# EAGLE design barometre_main_v2.2 (EAGLE 9.6.2)
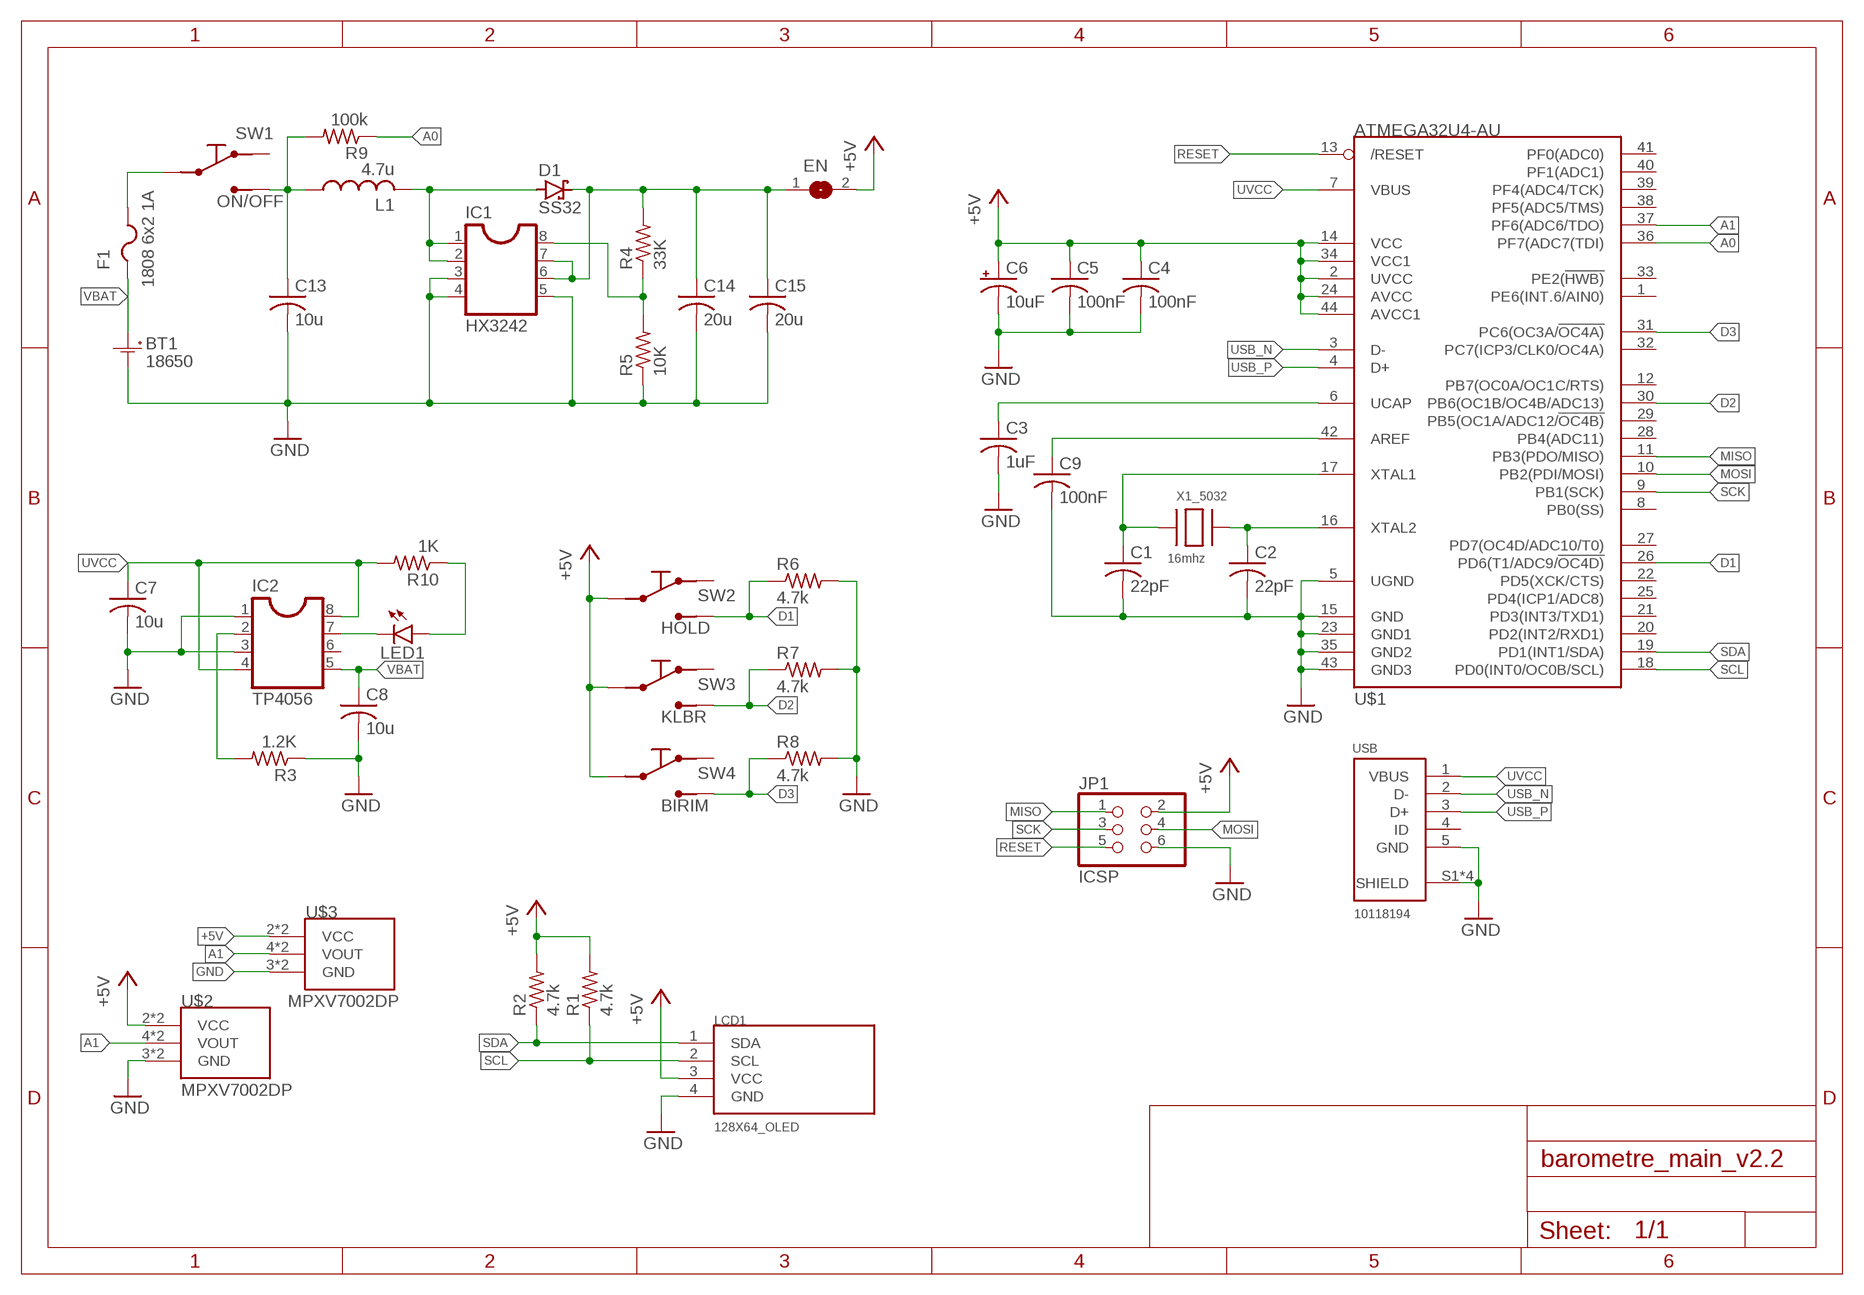
[diagram p0: schematic, sheet 1]

## Parts
BT1  18650  18650_BATTERY  [18650_PCB]
C1  22pF  C-USC0805  [C0805]
C2  22pF  C-USC0805  [C0805]
C3  1uF  C-USC0805  [C0805]
C4  100nF  C-USC0805  [C0805]
C5  100nF  C-USC0805  [C0805]
C6  10uF  CPOL-USSMCB  [SMC_B]
C7  10u  C-USC0805  [C0805]
C8  10u  C-USC0805  [C0805]
C9  100nF  C-USC0805  [C0805]
C13  10u  C-USC0805  [C0805]
C14  20u  C-USC0805  [C0805]
C15  20u  C-USC0805  [C0805]
D1  SS32  SCHOTTKY-DIODESMC  [SMC]
EN  SJ  [SJ]
F1  1808 6x2 1A  PTCFUSE-1812  [1812]
IC1  HX3242  IC_DIL8-SOIC8  [SO-8]
IC2  TP4056  IC_DIL8-SOIC8  [SO-8]
JP1  ICSP  PINHD-2X3  [2X03]
L1  4.7u  L-USL5650M  [L5650M]
LCD1  128X64_OLED  [128X64_OLED]
LED1  LEDCHIPLED_0805  [CHIPLED_0805]
R1  4.7k  R-US_R0805  [R0805]
R2  4.7k  R-US_R0805  [R0805]
R3  1.2K  R-US_R0805  [R0805]
R4  33K  R-US_R0805  [R0805]
R5  10K  R-US_R0805  [R0805]
R6  4.7k  R-US_R0805  [R0805]
R7  4.7k  R-US_R0805  [R0805]
R8  4.7k  R-US_R0805  [R0805]
R9  100k  R-US_R0805  [R0805]
R10  1K  R-US_R0805  [R0805]
SW1  ON/OFF  BUTTON_6_PIN  [BUTTON_6_PIN]
SW2  HOLD  BUTTON_6_PIN  [BUTTON_6_PIN]
SW3  KLBR  BUTTON_6_PIN  [BUTTON_6_PIN]
SW4  BIRIM  BUTTON_6_PIN  [BUTTON_6_PIN]
U$1  ATMEGA32U4-AU  [TQFP44]
U$2  MPXV7002DP  [MPXV7002DP]
U$3  MPXV7002DP  [MPXV7002DP]
USB  10118194  MICRO_USB  [10118194]
X1_5032  16mhz  XTALNX5032  [NX5032]

## Nets
+5V: C4.1 C5.1 C6.+ EN.2 JP1.2 LCD1.3(VCC) R1.2 R2.2 SW2.P$2 SW2.P$5 SW3.P$2 SW3.P$5 SW4.P$2 SW4.P$5 U$1.2(UVCC) U$1.14(VCC) U$1.24(AVCC) U$1.34(VCC1) U$1.44(AVCC1) U$2.2(VCC) U$2.P$2(VCC) U$3.2(VCC) U$3.P$2(VCC)
A0: R9.1 U$1.36(PF7(ADC7(TDI))
A1: U$1.37(PF6(ADC6/TDO)) U$2.4(VOUT) U$2.P$4(VOUT) U$3.4(VOUT) U$3.P$4(VOUT)
D1: R6.1 SW2.P$1 SW2.P$6 U$1.26(PD6(T1/ADC9/!OC4D))
D2: R7.1 SW3.P$1 SW3.P$6 U$1.30(PB6(OC1B/OC4B/ADC13))
D3: R8.1 SW4.P$1 SW4.P$6 U$1.31(PC6(OC3A/!OC4A))
GND: BT1.N C1.2 C2.2 C3.2 C4.2 C5.2 C6.- C7.2 C8.2 C9.2 C13.2 C14.2 C15.2 IC1.3 IC1.4 IC1.5 IC2.1 IC2.3 JP1.6 LCD1.4(GND) R3.1 R5.1 R6.2 R7.2 R8.2 U$1.5(UGND) U$1.15(GND) U$1.23(GND1) U$1.35(GND2) U$1.43(GND3) U$2.3(GND) U$2.P$3(GND) U$3.3(GND) U$3.P$3(GND) USB.5(GND) USB.S1(SHIELD) USB.S2(SHIELD) USB.S3(SHIELD) USB.S6(SHIELD)
MISO: JP1.1 U$1.11(PB3(PDO/MISO))
MOSI: JP1.4 U$1.10(PB2(PDI/MOSI))
N$1: IC2.2 R3.2
N$2: C3.1 U$1.6(UCAP)
N$3: C1.1 U$1.17(XTAL1) X1_5032.P$1
N$4: C2.1 U$1.16(XTAL2) X1_5032.P$2
N$5: LED1.A R10.1
N$6: F1.2 SW1.P$2 SW1.P$5
N$7: D1.A IC1.1 IC1.2 L1.2
N$8: C13.1 L1.1 R9.2 SW1.P$1 SW1.P$6
N$9: IC2.7 LED1.C
N$10: C9.1 U$1.42(AREF)
N$13: IC1.8 R4.1 R5.2
N$15: C14.1 C15.1 D1.C EN.1 IC1.6 IC1.7 R4.2
RESET: JP1.5 U$1.13(/RESET)
SCK: JP1.3 U$1.9(PB1(SCK))
SCL: LCD1.2(SCL) R1.1 U$1.18(PD0(INT0/OC0B/SCL))
SDA: LCD1.1(SDA) R2.1 U$1.19(PD1(INT1/SDA))
USB_N: U$1.3(D-) USB.2(D-)
USB_P: U$1.4(D+) USB.3(D+)
UVCC: C7.1 IC2.4 IC2.8 R10.2 U$1.7(VBUS) USB.1(VBUS)
VBAT: BT1.P C8.1 F1.1 IC2.5
Unconnected: IC2.6 SW1.P$3 SW1.P$4 SW2.P$3 SW2.P$4 SW3.P$3 SW3.P$4 SW4.P$3 SW4.P$4 U$1.1(PE6(INT.6/AIN0)) U$1.8(PB0(SS)) U$1.12(PB7(OC0A/OC1C/RTS)) U$1.20(PD2(INT2/RXD1)) U$1.21(PD3(INT3/TXD1)) U$1.22(PD5(XCK/CTS)) U$1.25(PD4(ICP1/ADC8)) U$1.27(PD7(OC4D/ADC10/T0)) U$1.28(PB4(ADC11)) U$1.29(PB5(OC1A/ADC12/!OC4B)) U$1.32(PC7(ICP3/CLK0/OC4A)) U$1.33(PE2(!HWB)) U$1.38(PF5(ADC5/TMS)) U$1.39(PF4(ADC4/TCK)) U$1.40(PF1(ADC1)) U$1.41(PF0(ADC0)) USB.4(ID)

## Library data of the parts
BT1 = 1-my-library:18650_BATTERY
C1-C5 C7-C9 C13-C15 = rcl:C-US: CAPACITOR, American symbol; SPICEPREFIX: C
C6 = rcl:CPOL-US: POLARIZED CAPACITOR, American symbol; SPICEPREFIX: C
D1 = diode:SCHOTTKY-DIODE: Schottky Diode
EN = jumper:SJ: SMD solder JUMPER
F1 = adafruit:PTCFUSE: PTC fuses, resettable thermistors
IC1 IC2 = dp_devices.v6:IC_DIL8: Universal 8pins IC
JP1 = pinhead:PINHD-2X3: PIN HEADER
L1 = rcl:L-US: INDUCTOR, American symbol; SPICEPREFIX: L
LCD1 = 1-my-library:128X64_OLED
LED1 = led:LED: LED OSRAM: - CHIPLED LG R971, LG N971, LY N971, LG Q971, LY Q971, LO R971, LY R971 LH N974, LH R974 LS Q976, LO Q976, LY Q976 LO Q996 - Hyper CHIPLED LW Q18S LB Q993, LB Q99A, LB R99A - SideLED LS A670, LO A670, LY A670, LG A670, LP A670 LB A673, LV A673, LT A673, LW A673 LH A674 LY A675 LS A676, LA A676, LO A676, LY A676, LW A676 LS A679, LY A679, LG A679 - Hyper Micro SIDELED® LS Y876, LA Y876, LO Y876, LY Y876 LT Y87S - SmartLED LW L88C, LW L88S LB L89C, LB L89S, LG L890 LS L89K, LO L89K, LY L89K LS L896, LA L896, LO L896, LY L896 - TOPLED LS T670, LO T670, LY T670, LG T670, LP T670 LSG T670, LSP T670, LSY T670, LOP T670, LYG T670 LG T671, LOG T671, LSG T671 LB T673, LV T673, LT T673, LW T673 LH T674 LS T676, LA T676, LO T676, LY T676, LB T676, LH T676, LSB T676, LW T676 LB T67C, LV T67C, LT T67C, LS T67K, LO T67K, LY T67K, LW E67C LS E67B, LA E67B, LO E67B, LY E67B, LB E67C, LV E67C, LT E67C LW T67C LS T679, LY T679, LG T679 LS T770, LO T770, LY T770, LG T770, LP T770 LB T773, LV T773, LT T773, LW T773 LH T774 LS E675, LA E675, LY E675, LS T675 LS T776, LA T776, LO T776, LY T776, LB T776 LHGB T686 LT T68C, LB T68C - Hyper Mini TOPLED® LB M676 - Mini TOPLED Santana® LG M470 LS M47K, LO M47K, LY M47K Source: http://www.osram.convergy.de LUXEON: - LUMILED® LXK2-PW12-R00, LXK2-PW12-S00, LXK2-PW14-U00, LXK2-PW14-V00 LXK2-PM12-R00, LXK2-PM12-S00, LXK2-PM14-U00 LXK2-PE12-Q00, LXK2-PE12-R00, LXK2-PE12-S00, LXK2-PE14-T00, LXK2-PE14-U00 LXK2-PB12-K00, LXK2-PB12-L00, LXK2-PB12-M00, LXK2-PB14-N00, LXK2-PB14-P00, LXK2-PB14-Q00 LXK2-PR12-L00, LXK2-PR12-M00, LXK2-PR14-Q00, LXK2-PR14-R00 LXK2-PD12-Q00, LXK2-PD12-R00, LXK2-PD12-S00 LXK2-PH12-R00, LXK2-PH12-S00 LXK2-PL12-P00, LXK2-PL12-Q00, LXK2-PL12-R00 Source: www.luxeon.com KINGBRIGHT: KA-3528ASYC Source: www.kingbright.com
R1-R10 = rcl:R-US_: RESISTOR, American symbol; SPICEPREFIX: R
SW1-SW4 = 1-my-library:BUTTON_6_PIN: 8x8 6 Pin Buton ve Anahtar
U$1 = adafruit:ATMEGA32U4: http://www.ladyada.net/library/eagle
U$2 U$3 = 1-my-library:MPXV7002DP
USB = 1-my-library:MICRO_USB: CONN RCPT USB2.0 MICRO B SMD R/A Manufacturer's datasheet <https://www.amphenol-icc.com/media/wysiwyg/files/drawing/10118194.pdf?__cf_chl_jschl_tk__=1e9b4569481076e99900b246ea640525553a7b60-1588047333-0-AZhEk6D50lwOf6CdaXmV1teudqMKHMxqtb1pEtnUtu77sOc-OVRjbCmHdORomVnr0W49D2E8XkcMdJ2SdWt5rDDYIblyJz7fSv-zilM8vQKAQDC1Z9aMVORhnMgYjPDuz8XpfDLul_eaqqFpemo1xIgoZv50WTuLMwu26ci7e02s9PWvR3z1cDqm9GMGYIPwIUd9yh5-TtN_o6DbEkadC7zoJlhYZSw-VEaYzfWnBSFg_n44fbEB3slHLR2YKLSiTmh8RSwpxKUP4gER0KeVoie9w-Ibtx3oKQbsZjrsPLGSu9BzV2nf3QeoErALCQuycvY9WhQdebLIpxaon6SXufpVIIdoKZHRpjuVVlAkUIr9oSIZGQzzOWY1-dWY48jVEOvnvoxw9-xup5uFcr7XWo0>; CREATED_BY: PCBLayout.com; DIGIKEY_PARTNO: 609-4618-2-ND; MANUFACTURER: Amphenol ICC (FCI); MPN: 10118194-0001LF
X1_5032 = adafruit:XTAL: Low cost SMT crystals, no capacitors included http://www.ladyada.net/library/eagle

## Board
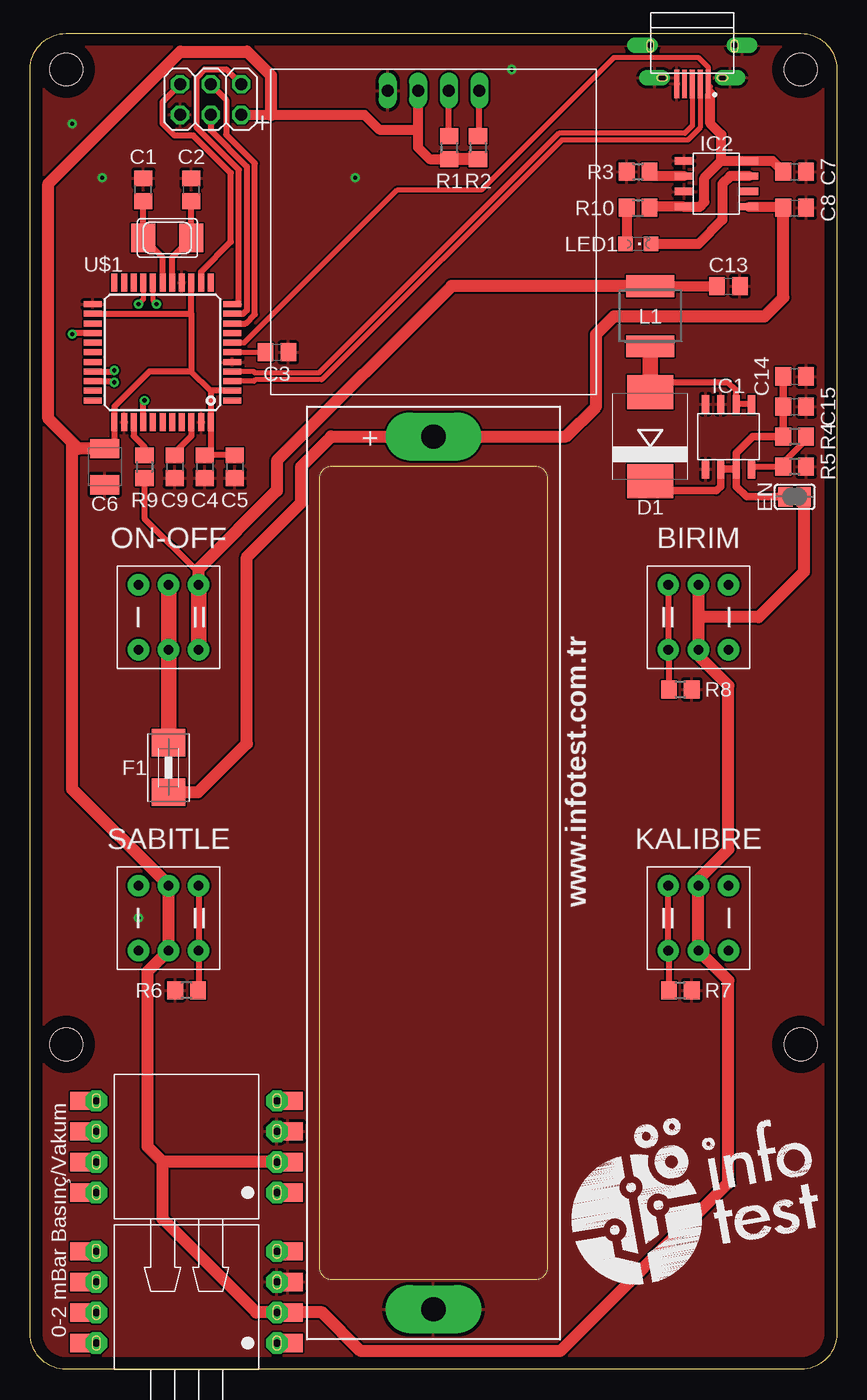
[diagram p1: board, top side]
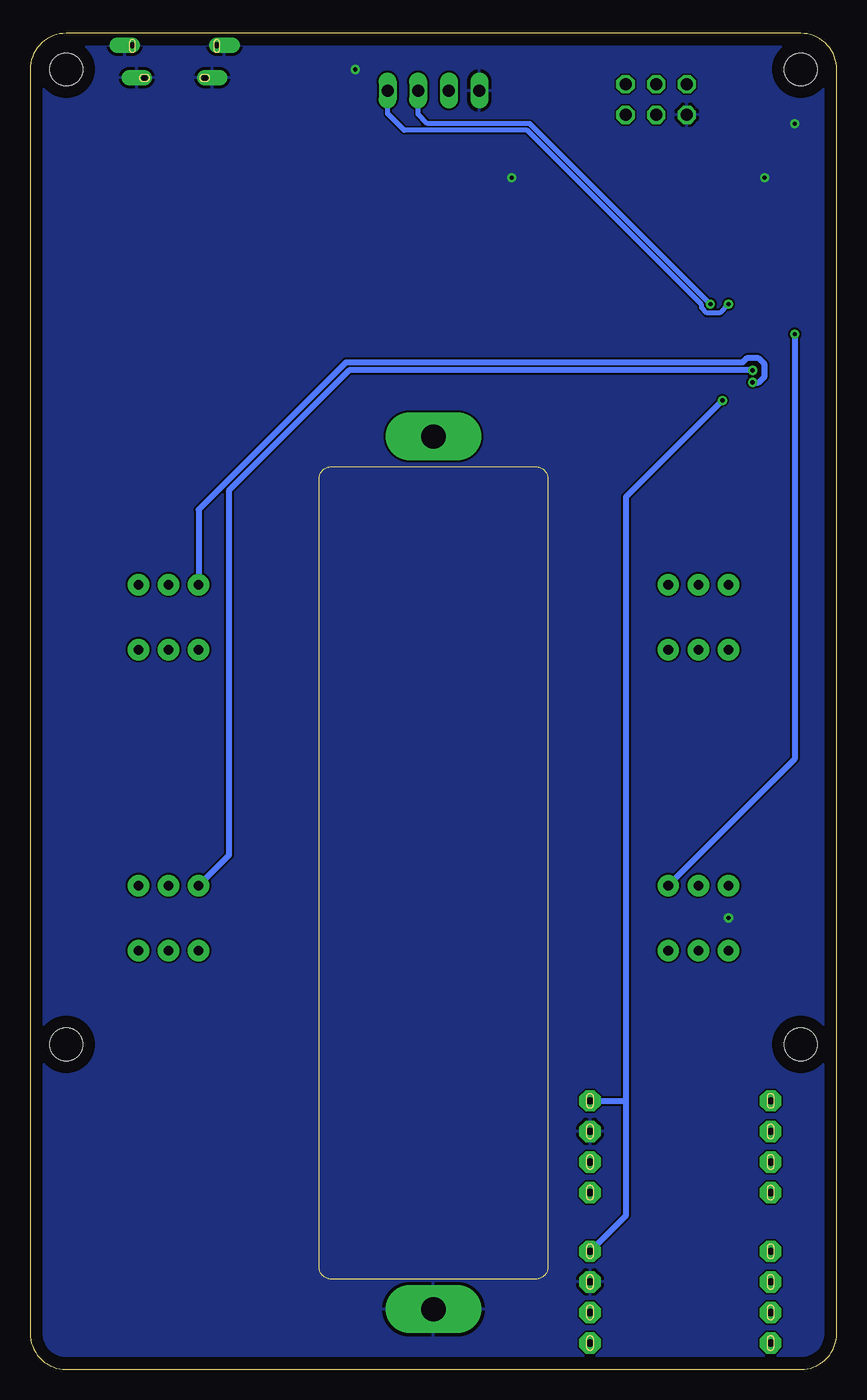
[diagram p2: board, bottom side, seen from below]

Size 67 x 111 mm. Coordinates in mm from the lower left corner, seen from the top.
Outline: 67,108 67,3 arc-90 64,0 3,0 arc-90 0,3 0,108 arc-90 3,111 64,111 arc-90 67,108
Copper layers (1*16): Top 0.035mm / dielectric 1.5mm / Bottom 0.035mm
Design rules "default": minimum track width 6mil, minimum drill 0.35mm, track to track 6mil, track to pad 6mil, pad to pad 6mil, via to via 6mil, smd to smd 6mil, copper to edge 40mil, drill to drill 6mil, minimum pad ring 10mil, minimum via ring 8mil, stop-mask expansion 4mil, vias tented up to drill 0mil, thermal gap 10mil
Holes 2.7 mm at 3,27 64,27 3,108 64,108

### Footprints (pad centres in the part's own frame; a part is rotated, then mirrored left to right if it is on the bottom)
18650_PCB = drill 2 pad 4 long: N 0,2.5; P 0,75
C0805 = smd 1.3 x 1.5: 1 -0.95,0; 2 0.95,0
SMC_B = smd 1.6 x 2.4: + -1.5,0; - 1.5,0
SMC = smd 2.8 x 3.8: A 3.7,0; C -3.7,0
SJ = smd 1.168 x 1.6: 1 -0.762,0; 2 0.762,0
1812 = smd 2.286 x 2.794: 1 -2.046,0; 2 2.046,0
SO-8 = smd 0.6 x 1.55: 1 -1.905,-2.69; 2 -0.635,-2.69; 3 0.635,-2.69; 4 1.905,-2.69; 5 1.905,2.71; 6 0.635,2.71; 7 -0.635,2.71; 8 -1.905,2.71
2X03 = drill 1.016 octagon: 1 -2.54,-1.27; 2 -2.54,1.27; 3 0,-1.27; 4 0,1.27; 5 2.54,-1.27; 6 2.54,1.27
L5650M = smd 1.8 x 4: 1 -2.5,0; 2 2.5,0
128X64_OLED = drill 1 long: 1 3.81,11.75; 2 1.27,11.75; 3 -1.27,11.75; 4 -3.81,11.75
CHIPLED_0805 = smd 1.2 x 1.2: A 0,-1.05; C 0,1.05
R0805 = smd 1.3 x 1.5: 1 -0.95,0; 2 0.95,0
BUTTON_6_PIN = drill 0.8 pad 1.778: P$1 2.7,-2.5; P$2 2.7,0; P$3 2.7,2.5; P$4 -2.7,2.5; P$5 -2.7,0; P$6 -2.7,-2.5
TQFP44 = smd 1.5 x 0.5: 1 -5.8,4; 2 -5.8,3.2; 3 -5.8,2.4; 4 -5.8,1.6; 5 -5.8,0.8; 6 -5.8,0; 7 -5.8,-0.8; 8 -5.8,-1.6; 9 -5.8,-2.4; 10 -5.8,-3.2; 11 -5.8,-4; 23 5.8,-4; 24 5.8,-3.2; 25 5.8,-2.4; 26 5.8,-1.6; 27 5.8,-0.8; 28 5.8,0; 29 5.8,0.8; 30 5.8,1.6; 31 5.8,2.4; 32 5.8,3.2; 33 5.8,4 | smd 0.5 x 1.5: 12 -4,-5.8; 13 -3.2,-5.8; 14 -2.4,-5.8; 15 -1.6,-5.8; 16 -0.8,-5.8; 17 0,-5.8; 18 0.8,-5.8; 19 1.6,-5.8; 20 2.4,-5.8; 21 3.2,-5.8; 22 4,-5.8; 34 4,5.8; 35 3.2,5.8; 36 2.4,5.8; 37 1.6,5.8; 38 0.8,5.8; 39 0,5.8; 40 -0.8,5.8; 41 -1.6,5.8; 42 -2.4,5.8; 43 -3.2,5.8; 44 -4,5.8
MPXV7002DP = smd 2.54 x 1.52: 1 8.38,-3.81; 2 8.38,-1.27; 3 8.38,1.27; 4 8.38,3.81; 5 -8.38,3.81; 6 -8.38,1.27; 7 -8.38,-1.27; 8 -8.38,-3.81 | drill 0.6 pad 1.778 octagon: P$1 7.5,-3.81; P$2 7.5,-1.27; P$3 7.5,1.27; P$4 7.5,3.81; P$5 -7.5,3.81; P$6 -7.5,1.27; P$7 -7.5,-1.27; P$8 -7.5,-3.81
10118194 = smd 0.4 x 2.35: 1 -1.3,3.2; 2 -0.65,3.2; 3 0,3.2; 4 0.65,3.2; 5 1.3,3.2 | drill 0.55 pad 1.27 offset: S1 -2.5,2.7; S2 2.5,2.7 | drill 0.5 pad 1.27 offset: S3 -3.5,0; S6 3.5,0
NX5032 = smd 2 x 2.4: P$1 2,0; P$2 -2,0

### Placement (x,y rotation side)
BT1  33.5,2.5 0 top
C1  9.4,98 90 top
C2  13.4,98 90 top
C3  20.5,84.5 0 top
C4  14.5,75 270 top
C5  17,75 270 top
C6  6.2,75 270 top
C7  63.5,99.5 0 top
C8  63.5,96.5 0 top
C9  12,75 270 top
C13  58,90 0 top
C14  63.5,82.5 0 top
C15  63.5,80 0 top
D1  51.5,77.5 90 top
EN  63.5,72.5 0 top
F1  11.5,50 90 top
IC1  58,77.5 180 top
IC2  57,98.5 270 top
JP1  15,105.5 180 top
L1  51.5,87.5 270 top
LCD1  33.5,94.5 0 top
LED1  50.5,93.5 270 top
R1  34.8,101.5 270 top
R2  37.2,101.5 270 top
R3  50.5,99.5 0 top
R4  63.5,77.5 180 top
R5  63.5,75 180 top
R6  13,31.5 180 top
R7  54,31.5 0 top
R8  54,56.5 0 top
R9  9.5,75 270 top
R10  50.5,96.5 0 top
SW1  11.5,62.5 90 top
SW2  11.5,37.5 90 top
SW3  55.5,37.5 270 top
SW4  55.5,62.5 270 top
U$1  11,84.5 180 top
U$2  13,6 0 top
U$3  13,18.5 0 top
USB  55,110 180 top
X1_5032  11.4,94 180 top

### Tracks (layer width: path | path; a pad name or v marks a point on that pad's centre or on a via)
+5V
  Top 0.508: 15,81.3 U$1.44 15,76.45 C4.1 C5.1 | U$1.2 15,81.3 | 15,81.3 13.4,82.9 | 13.4,87.7 U$1.14 | U$1.24 13.4,87.7 | 13.4,87.7 13.4,82.9 | 13.4,82.9 9.9,82.9 7,80 U$1.34 7,76.8 6.7,76.5 C6.+
  Top 0.813: 32.23,103 32.23,101.5 33.18,100.55 R1.2 | 32.23,103 LCD1.3 | JP1.2 20,104.23 27.77,104.23 29,103 32.23,103
  Top 1.016: R2.2 R1.2 | SW4.P$5 55.5,62.5 | 55.5,62.5 SW4.P$2 55.5,59.3 58,56.8 58,43.2 55.5,40.7 SW3.P$5 SW3.P$2 58,32.3 58,15.5 44.02,1.52 27.48,1.52 24.27,4.73 U$2.2 | U$2.2 U$2.P$2 | U$2.2 18.77,4.73 11,12.5 11,17.2 11.03,17.23 | C6.+ 4,76.5 3.5,77 | 3.5,77 3.5,48.2 SW2.P$2 SW2.P$5 9.74,33.04 9.74,18.52 11.03,17.23 | 3.5,77 1.52,78.98 1.52,98.52 12.48,109.48 18.02,109.48 20,107.5 20,104.23 | EN.2 64.26,66.26 60.5,62.5 55.5,62.5 | U$3.P$2 U$3.2 11.03,17.23
A0
  Top 0.508: U$1.36 8.6,77.55 9.5,76.65 R9.1
A1  (via drill 0.35)
  Top 0.508: U$1.37 9.4,80.4 v9.5,80.5
  Top 0.813: U$2.4 U$2.P$4
  Top 1.016: U$3.4 U$3.P$4
  Bottom 0.508: U$2.P$4 17.5,12.81 17.5,22.3 | 17.5,22.3 17.5,72.5 v9.5,80.5 | U$3.P$4 17.51,22.31 17.5,22.3
D1  (via drill 0.35)
  Top 0.508: SW2.P$1 SW2.P$6 14,31.55 R6.1 | U$1.26 3.6,86.1 v3.5,86
  Bottom 0.508: v3.5,86 3.5,50.7 SW2.P$1
D2  (via drill 0.35)
  Top 0.508: SW3.P$6 SW3.P$1 53.05,34.75 R7.1 | U$1.30 6.9,82.9 v7,83
  Bottom 0.508: v7,83 40.5,83 50.5,73 50.5,42.7 SW3.P$6
D3  (via drill 0.35)
  Top 0.508: SW4.P$6 SW4.P$1 53.05,59.75 R8.1 | U$1.31 6.9,82.1 v7,82
  Bottom 0.508: v7,82 6.5,82 6,82.5 6,83.5 6.5,84 7.5,84 7.84,83.66 40.77,83.66 53,71.43 SW4.P$6
GND  (via drill 0.35)
  other vias: 9,37.5 40,108 27,99 3.5,103.5 6,99
  pour Top: 3,0 arc-90 0,3 0,108 arc-90 3,111 64,111 arc-90 67,108 67,3 arc-90 64,0
  pour Bottom: 3,0 arc-90 0,3 0,108 arc-90 3,111 64,111 arc-90 67,108 67,3 arc-90 64,0
MISO
  Top 0.508: U$1.11 17.34,88.5 17.34,99.66 13.83,103.17 13.83,107.33 14.5,108 16.31,108 JP1.1
MOSI
  Top 0.508: U$1.10 17.7,87.7 18,88 18,99.93 15,102.93 JP1.4
N$1
  Top 0.813: IC2.2 51.81,99.14 R3.2
N$2
  Top 0.406: U$1.6 C3.1
N$3
  Top 0.508: U$1.17 11,92.4 X1_5032.P$1 C1.1
N$4
  Top 0.508: U$1.16 11.8,92.4 X1_5032.P$2 C2.1
N$5
  Top 0.813: R10.1 49.55,93.6 LED1.A
N$6
  Top 1.27: SW1.P$2 SW1.P$5 F1.2
N$7
  Top 0.508: IC1.1 IC1.2 58.63,81.36 58,82 52.3,82 D1.A
  Top 1.27: L1.2 D1.A
N$8
  Top 0.508: SW1.P$1 14,66.2 9.5,70.7 R9.2
  Top 0.813: L1.1 C13.1
  Top 1.016: SW1.P$1 14,66.5 20.5,73 20.5,75.5 35,90 L1.1
  Top 1.27: SW1.P$6 SW1.P$1
N$9
  Top 0.813: IC2.7 58.13,99.14 57.5,98.5 57.5,95.5 55.5,93.5 LED1.C
N$10
  Top 0.508: U$1.42 13.4,77.55 12,76.15 C9.1
N$13
  Top 0.508: IC1.8 60.12,75 R5.2 62.8,75.25 62.8,75.6 64.2,77 64.2,77.25 R4.1
N$15
  Top 0.61: D1.C 52.3,73 57,73 57.37,73.36 IC1.6 IC1.7 | IC1.7 58.63,76.14 60,77.5 R4.2 C15.1 C14.1 | IC1.7 58.63,73.36 59.5,72.5 EN.1
RESET
  Top 0.508: U$1.13 14.2,91.2 16.68,93.68 16.68,99.39 13.57,102.5 12,102.5 11,103.5 11,105.31 JP1.5
SCK
  Top 0.508: U$1.9 17.9,86.9 18.66,87.66 18.66,100.21 16.27,102.6 16.27,105.5 JP1.3
SCL  (via drill 0.35)
  Top 0.406: U$1.18 10.2,88.8 v10.5,88.5
  Top 0.508: R1.1 34.77,102.48 LCD1.2
  Bottom 0.406: v10.5,88.5 25.5,103.5 34,103.5 34.77,104.27 LCD1.2
SDA  (via drill 0.35)
  Top 0.406: U$1.19 9.4,88.9 v9,88.5
  Top 0.508: R2.1 37.31,102.56 LCD1.1
  Bottom 0.406: v9,88.5 9.73,87.77 10.8,87.77 11.23,88.2 11.23,88.44 25.73,102.94 35.94,102.94 37.31,104.31 LCD1.1
USB_N
  Top 0.406: USB.2 55.65,103.17 54.62,102.14 44.14,102.14 24.22,82.22 18.7,82.22 18.58,82.1 U$1.3
USB_P
  Top 0.406: USB.3 55,103.31 54.39,102.7 43.91,102.7 23.99,82.78 18.69,82.78 18.57,82.9 U$1.4
UVCC
  Top 0.406: 56.5,106 56.5,106.6 USB.1 56.3,108.2 55.5,109 48.5,109 37.5,98 30.5,98 17.8,85.3 U$1.7
  Top 0.813: R10.2 51.55,96.59 IC2.4 55.59,96.59 56,97 56,99 57.41,100.41 | C7.1 61.65,100.41 IC2.8 57.41,100.41 | 57.41,100.41 57.41,102.59 56.5,103.5 56.5,106
VBAT
  Top 0.813: IC2.5 62.45,96.59 C8.1
  Top 1.016: F1.1 13.95,47.95 18,52 18,67.5 22.5,72 22.5,75 25,77.5 BT1.P 44.5,77.5 47,80 47,86 48.5,87.5 61,87.5 62.55,89.05 C8.1

### Text on the board
tPlace: + | + | www.infotest.com.tr